# EAGLE design ArduinoLFO_Main (EAGLE 7.2.0)
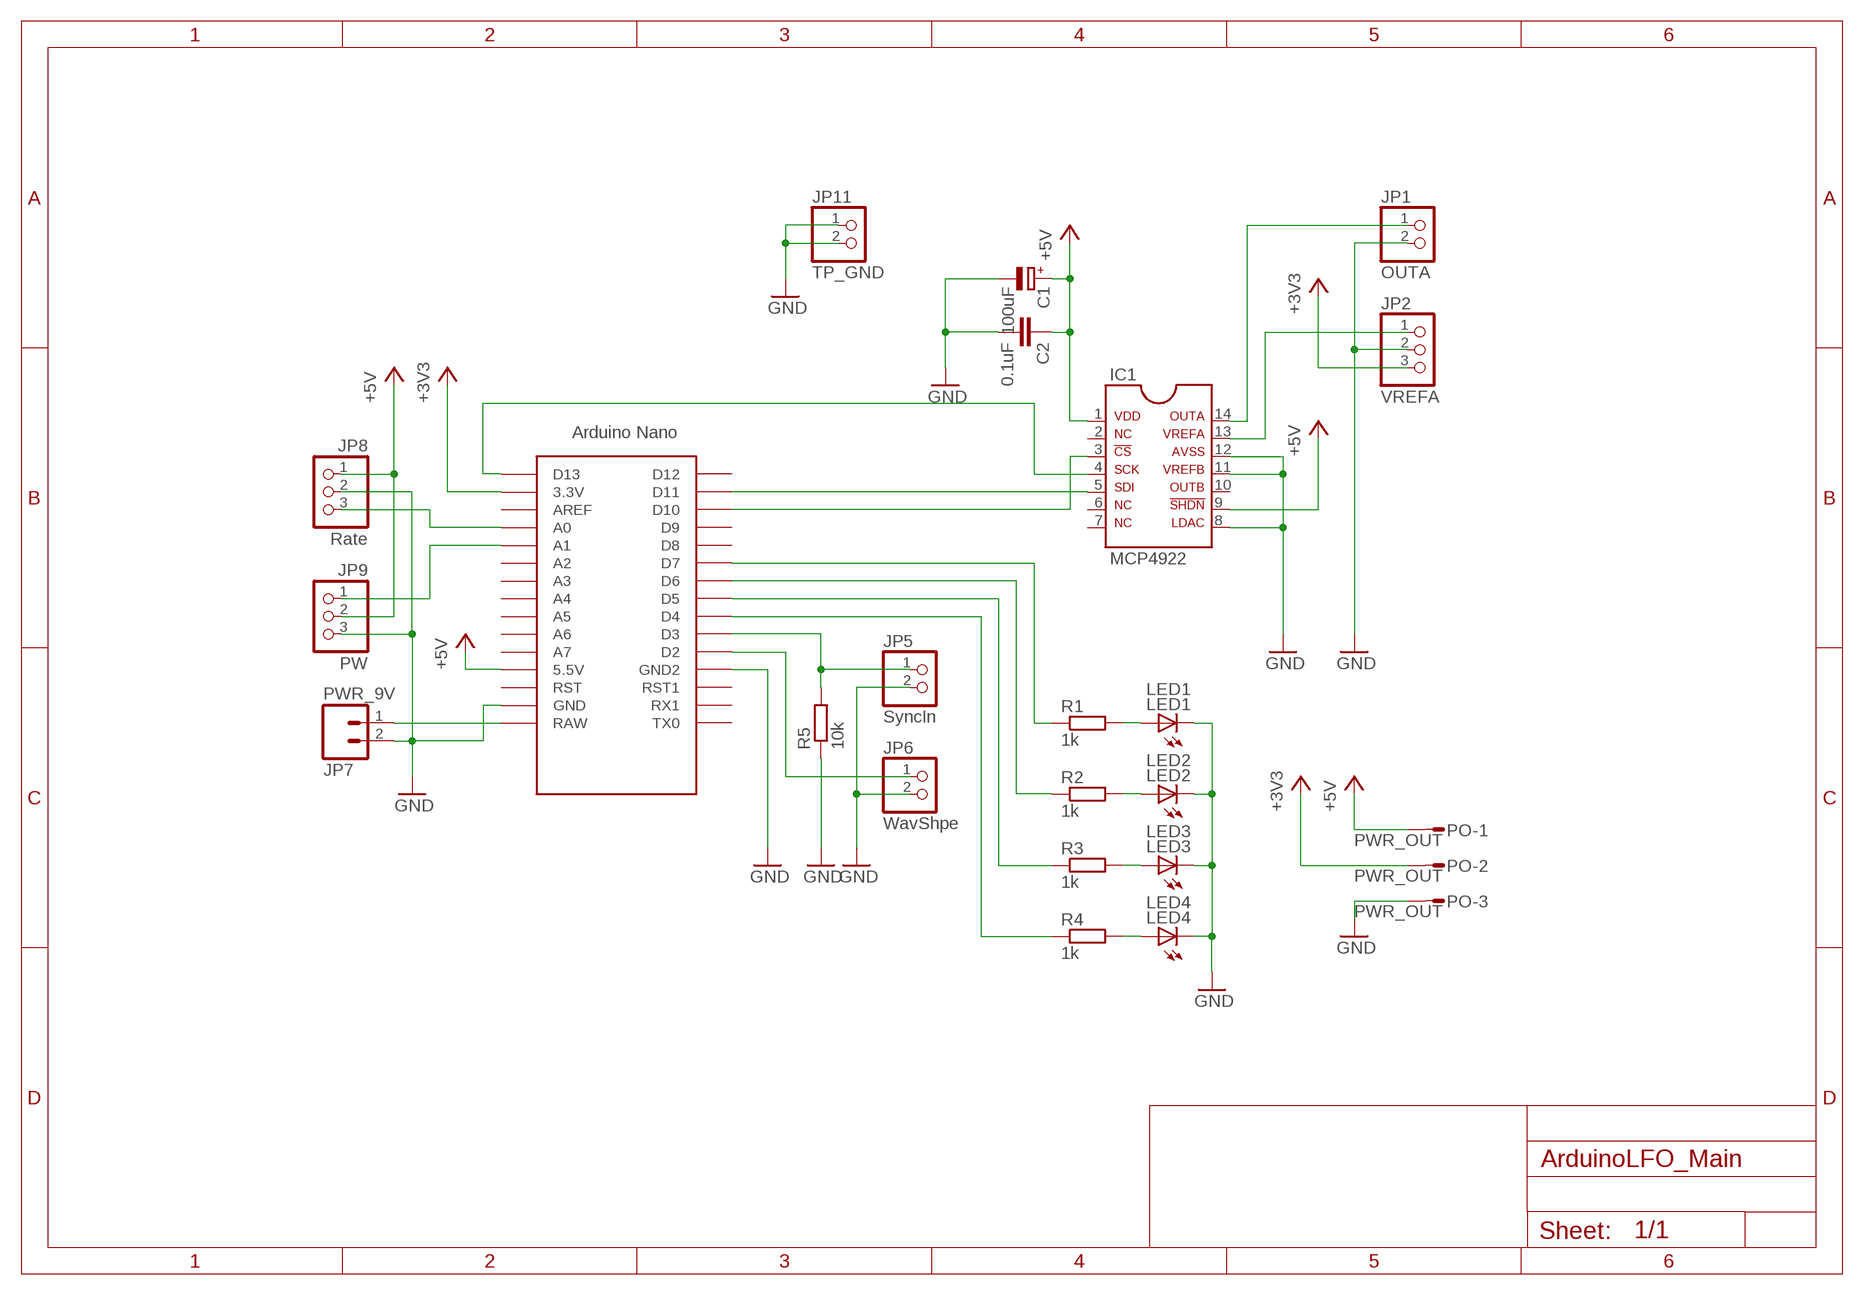
[diagram p0: schematic, sheet 1]

## Parts
C1  100uF  CPOL-EUE2.5-7  [E2,5-7]
C2  0.1uF  C-EU025-024X044  [C025-024X044]
IC1  MCP4922  [MCP4922]
JP1  OUTA  PINHD-1X2  [1X02]
JP2  VREFA  PINHD-1X3  [1X03]
JP5  SyncIn  PINHD-1X2  [1X02]
JP6  WavShpe  PINHD-1X2  [1X02]
JP7  PWR_9V  MA02  [02PA]
JP8  Rate  PINHD-1X3  [1X03]
JP9  PW  PINHD-1X3  [1X03]
JP11  TP_GND  PINHD-1X2  [1X02]
LED1  LED1  LED3MM  [LED3MM]
LED2  LED2  LED3MM  [LED3MM]
LED3  LED3  LED3MM  [LED3MM]
LED4  LED4  LED3MM  [LED3MM]
PO  PWR_OUT  MA03S  [03PA]
R1  1k  R-EU_0204/2V  [0204V]
R2  1k  R-EU_0204/2V  [0204V]
R3  1k  R-EU_0204/2V  [0204V]
R4  1k  R-EU_0204/2V  [0204V]
R5  10k  R-EU_0207/7  [0207/7]
U$1  NANO  [NANO]

## Nets
+3V3: JP2.3 PO.2 U$1.3.3V
+5V: C1.+ C2.1 IC1.1 IC1.9 JP8.1 JP9.2 PO.1 U$1.5V(5.5V)
GND: C1.- C2.2 IC1.8 IC1.11 IC1.12 JP1.2 JP2.2 JP5.2 JP6.2 JP7.2 JP8.2 JP9.3 JP11.1 JP11.2 LED1.K(C) LED2.K(C) LED3.K(C) LED4.K(C) PO.3 R5.1 U$1.GND U$1.GND1(GND2)
N$1: IC1.4 U$1.D13
N$2: IC1.5 U$1.D11
N$3: IC1.3 U$1.D10
N$4: JP8.3 U$1.A0
N$6: IC1.14 JP1.1
N$7: IC1.13 JP2.1
N$10: JP9.1 U$1.A1
N$11: JP7.1 U$1.RAW
N$15: LED1.A R1.2
N$16: LED2.A R2.2
N$17: LED3.A R3.2
N$18: LED4.A R4.2
N$19: R1.1 U$1.D7
N$20: R2.1 U$1.D6
N$21: R3.1 U$1.D5
N$22: R4.1 U$1.D4
N$23: JP5.1 R5.2 U$1.D3
N$24: JP6.1 U$1.D2
Unconnected: IC1.2 IC1.6 IC1.7 IC1.10 U$1.A2 U$1.A3 U$1.A4 U$1.A5 U$1.A6 U$1.A7 U$1.AREF U$1.D8 U$1.D9 U$1.D12 U$1.ICSP1 U$1.ICSP2 U$1.ICSP3 U$1.ICSP4 U$1.ICSP5 U$1.ICSP6 U$1.RST U$1.RST1 U$1.RX1 U$1.TX0

## Library data of the parts
C1 = rcl:CPOL-EU: POLARIZED CAPACITOR, European symbol
C2 = rcl:C-EU: CAPACITOR, European symbol
IC1 = mylib2:MCP4922
JP1 JP5 JP6 = my_pinhead:PINHD-1X2: PIN HEADER
JP2 = my_pinhead:PINHD-1X3: PIN HEADER
JP7 = con-amp-quick:MA02: AMP QUICK CONNECTOR; OC_FARNELL: unknown; OC_NEWARK: unknown
JP8 JP9 = pinhead:PINHD-1X3: PIN HEADER
JP11 = pinhead:PINHD-1X2: PIN HEADER
LED1-LED4 = led:LED: LED OSRAM: - CHIPLED LG R971, LG N971, LY N971, LG Q971, LY Q971, LO R971, LY R971 LH N974, LH R974 LS Q976, LO Q976, LY Q976 LO Q996 - Hyper CHIPLED LW Q18S LB Q993, LB Q99A, LB R99A - SideLED LS A670, LO A670, LY A670, LG A670, LP A670 LB A673, LV A673, LT A673, LW A673 LH A674 LY A675 LS A676, LA A676, LO A676, LY A676, LW A676 LS A679, LY A679, LG A679 - Hyper Micro SIDELED® LS Y876, LA Y876, LO Y876, LY Y876 LT Y87S - SmartLED LW L88C, LW L88S LB L89C, LB L89S, LG L890 LS L89K, LO L89K, LY L89K LS L896, LA L896, LO L896, LY L896 - TOPLED LS T670, LO T670, LY T670, LG T670, LP T670 LSG T670, LSP T670, LSY T670, LOP T670, LYG T670 LG T671, LOG T671, LSG T671 LB T673, LV T673, LT T673, LW T673 LH T674 LS T676, LA T676, LO T676, LY T676, LB T676, LH T676, LSB T676, LW T676 LB T67C, LV T67C, LT T67C, LS T67K, LO T67K, LY T67K, LW E67C LS E67B, LA E67B, LO E67B, LY E67B, LB E67C, LV E67C, LT E67C LW T67C LS T679, LY T679, LG T679 LS T770, LO T770, LY T770, LG T770, LP T770 LB T773, LV T773, LT T773, LW T773 LH T774 LS E675, LA E675, LY E675, LS T675 LS T776, LA T776, LO T776, LY T776, LB T776 LHGB T686 LT T68C, LB T68C - Hyper Mini TOPLED® LB M676 - Mini TOPLED Santana® LG M470 LS M47K, LO M47K, LY M47K Source: http://www.osram.convergy.de LUXEON: - LUMILED® LXK2-PW12-R00, LXK2-PW12-S00, LXK2-PW14-U00, LXK2-PW14-V00 LXK2-PM12-R00, LXK2-PM12-S00, LXK2-PM14-U00 LXK2-PE12-Q00, LXK2-PE12-R00, LXK2-PE12-S00, LXK2-PE14-T00, LXK2-PE14-U00 LXK2-PB12-K00, LXK2-PB12-L00, LXK2-PB12-M00, LXK2-PB14-N00, LXK2-PB14-P00, LXK2-PB14-Q00 LXK2-PR12-L00, LXK2-PR12-M00, LXK2-PR14-Q00, LXK2-PR14-R00 LXK2-PD12-Q00, LXK2-PD12-R00, LXK2-PD12-S00 LXK2-PH12-R00, LXK2-PH12-S00 LXK2-PL12-P00, LXK2-PL12-Q00, LXK2-PL12-R00 Source: www.luxeon.com KINGBRIGHT: KA-3528ASYC Source: www.kingbright.com
PO = con-amp-quick:MA03S: AMP QUICK CONNECTOR; OC_FARNELL: unknown; OC_NEWARK: unknown
R1-R5 = rcl:R-EU_: RESISTOR, European symbol
U$1 = Arduino-clone:NANO: Arduino Nano

## Board
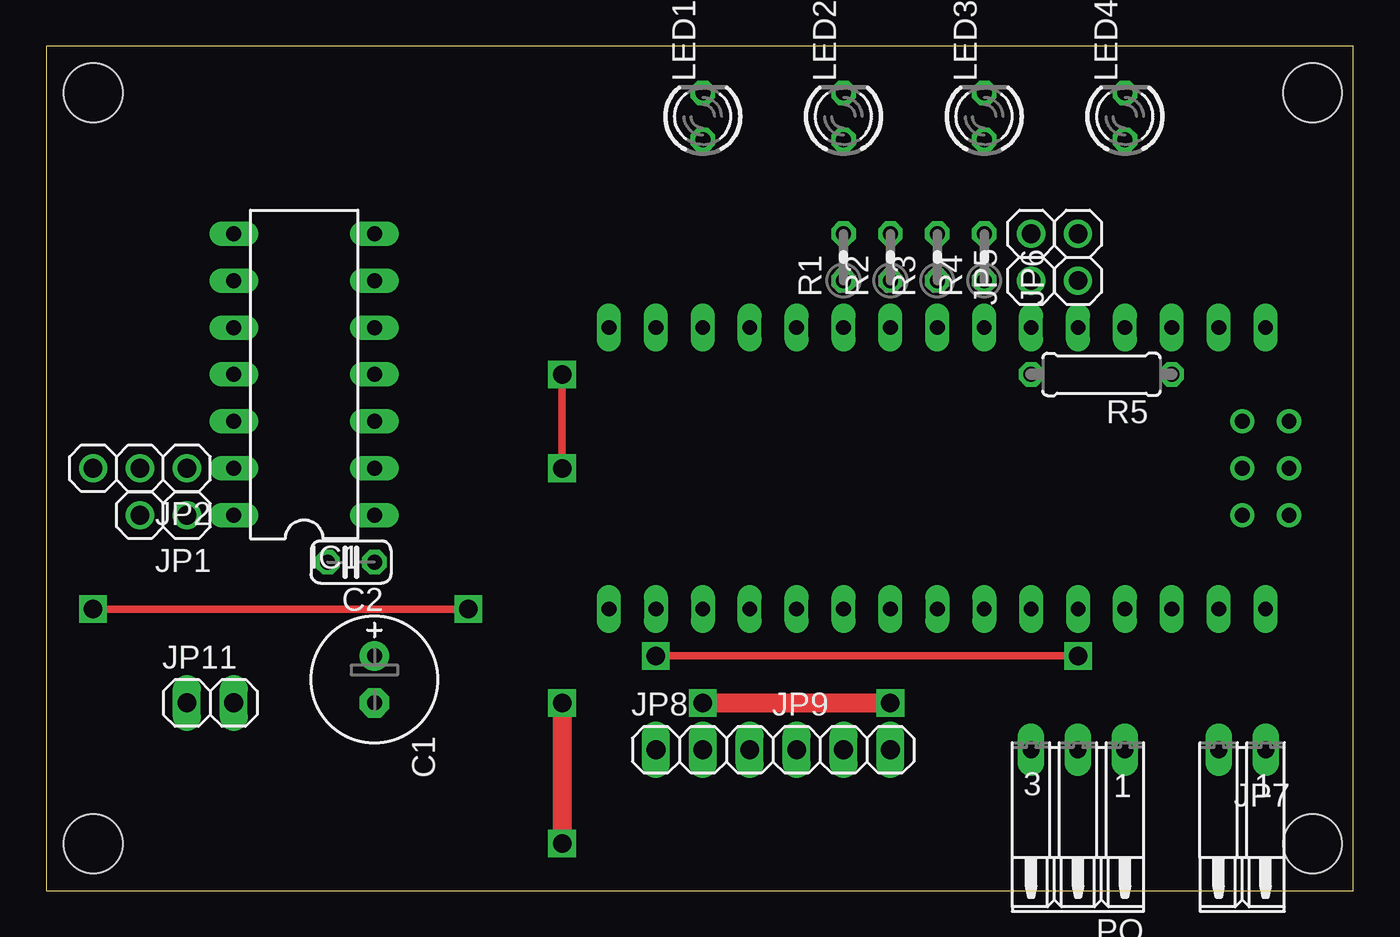
[diagram p1: board, top side]
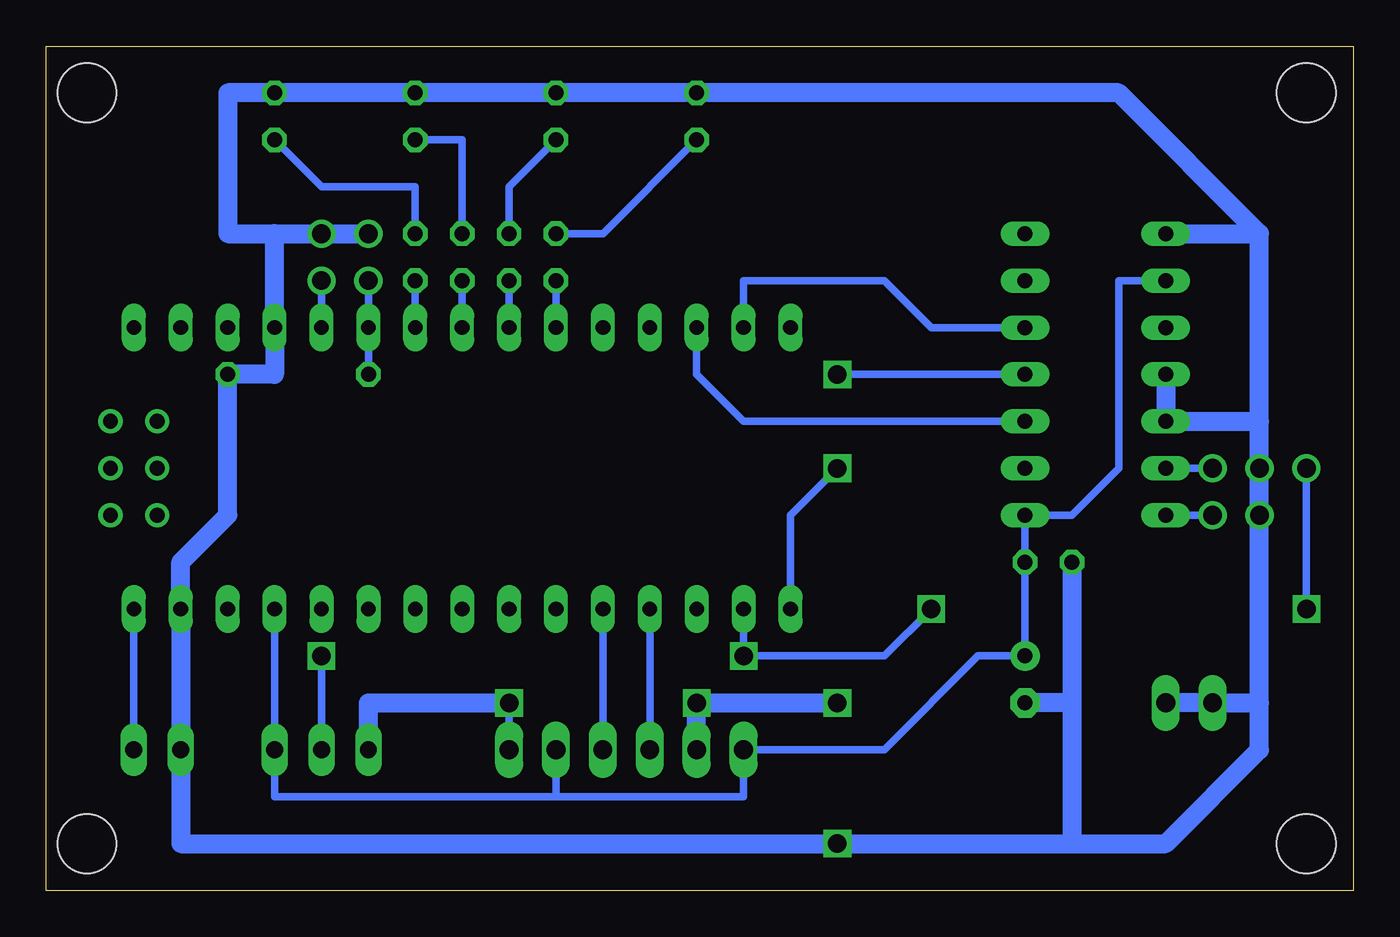
[diagram p2: board, bottom side, seen from below]

Size 70.79 x 45.71 mm. Coordinates in mm from the lower left corner, seen from the top.
Outline: 0,0 70.79,0 70.79,45.71 0,45.71 0,0
Copper layers (1*16): Top 0.035mm / dielectric 1.5mm / Bottom 0.035mm
Design rules "default": minimum track width 10mil, minimum drill 24mil, track to track 8mil, track to pad 8mil, pad to pad 8mil, via to via 8mil, smd to smd 8mil, copper to edge 40mil, drill to drill 8mil, minimum pad ring 10mil, minimum via ring 8mil, stop-mask expansion 4mil, vias tented up to drill 0mil, thermal gap 10mil
Holes 3.2 mm at 2.54,2.54 2.54,43.18 68.58,43.18 68.58,2.54

### Footprints (pad centres in the part's own frame; a part is rotated, then mirrored left to right if it is on the bottom)
E2,5-7 = drill 0.813 pad 1.6: + -1.27,0 | drill 0.813 pad 1.6 octagon: - 1.27,0
C025-024X044 = drill 0.813 octagon: 1 -1.27,0; 2 1.27,0
MCP4922 = drill 0.813 long: 1 -6.35,-3.81; 2 -3.81,-3.81; 3 -1.27,-3.81; 4 1.27,-3.81; 5 3.81,-3.81; 6 6.35,-3.81; 7 8.89,-3.81; 8 8.89,3.81; 9 6.35,3.81; 10 3.81,3.81; 11 1.27,3.81; 12 -1.27,3.81; 13 -3.81,3.81; 14 -6.35,3.81
1X02 = drill 1.016: 1 -1.27,0; 2 1.27,0
1X03 = drill 1.016: 1 -2.54,0; 2 0,0; 3 2.54,0
02PA = drill 0.914 long: 1 -1.27,0; 2 1.27,0
1X03' = drill 1.016 long: 1 -2.54,0; 2 0,0; 3 2.54,0
1X02' = drill 1.016 long: 1 -1.27,0; 2 1.27,0
LED3MM = drill 0.813 octagon: A -1.27,0; K 1.27,0
03PA = drill 0.914 long: 1 -2.54,0; 2 0,0; 3 2.54,0
0204V = drill 0.813 octagon: 1 -1.27,0; 2 1.27,0
0207/7 = drill 0.813 octagon: 1 -3.81,0; 2 3.81,0
NANO = drill 0.8 long: 3.3V -10.16,24.13; 5V -10.16,-1.27; A0 -10.16,19.05; A1 -10.16,16.51; A2 -10.16,13.97; A3 -10.16,11.43; A4 -10.16,8.89; A5 -10.16,6.35; A6 -10.16,3.81; A7 -10.16,1.27; AREF -10.16,21.59; D2 5.08,1.27; D3 5.08,3.81; D4 5.08,6.35; D5 5.08,8.89; D6 5.08,11.43; D7 5.08,13.97; D8 5.08,16.51; D9 5.08,19.05; D10 5.08,21.59; D11 5.08,24.13; D12 5.08,26.67; D13 -10.16,26.67; GND -10.16,-6.35; GND1 5.08,-1.27; RAW -10.16,-8.89; RST -10.16,-3.81; RST1 5.08,-3.81; RX1 5.08,-6.35; TX0 5.08,-8.89 | drill 0.8: ICSP1 -5.08,-10.16; ICSP2 -5.08,-7.62; ICSP3 -2.54,-10.16; ICSP4 -2.54,-7.62; ICSP5 0,-10.16; ICSP6 0,-7.62

### Placement (x,y rotation side)
C1  17.78,11.43 270 top
C2  16.51,17.78 180 top
IC1  13.97,26.67 90 top
JP1  6.35,20.32 180 top
JP2  5.08,22.86 180 top
JP5  53.34,34.29 90 top
JP6  55.88,34.29 90 top
JP7  64.77,7.62 180 top
JP8  Rate  [1X03']  35.56,7.62 0 top
JP9  PW  [1X03']  43.18,7.62 0 top
JP11  TP_GND  [1X02']  8.89,10.16 0 top
LED1  35.56,41.91 90 top
LED2  43.18,41.91 90 top
LED3  50.8,41.91 90 top
LED4  58.42,41.91 90 top
PO  55.88,7.62 180 top
R1  43.18,34.29 90 top
R2  45.72,34.29 90 top
R3  48.26,34.29 90 top
R4  50.8,34.29 90 top
R5  57.15,27.94 180 top
U$1  57.15,25.4 90 top

### Tracks (layer width: path | path; a pad name or v marks a point on that pad's centre or on a via)
+3V3  (via drill 1)
  Top 0.406: v33.02,12.7 v55.88,12.7 | v2.54,15.24 v22.86,15.24
  Bottom 0.406: U$1.3.3V v33.02,12.7 25.4,12.7 v22.86,15.24 | v55.88,12.7 PO.2 | JP2.3 v2.54,15.24
+5V
  Bottom 0.406: 43.18,5.08 58.42,5.08 PO.1 U$1.5V | 43.18,5.08 33.02,5.08 JP8.1 25.4,7.62 20.32,12.7 C1.+ C2.1 IC1.1 15.24,20.32 12.7,22.86 12.7,33.02 IC1.9 | JP9.2 43.18,5.08
GND  (via drill 1)
  Top 1.016: v35.56,10.16 v45.72,10.16 | v27.94,10.16 v27.94,2.54
  Bottom 0.406: v45.72,10.16 JP9.3
  Bottom 1.016: 5.08,25.4 JP2.2 JP1.2 5.08,10.16 | 5.08,25.4 5.08,35.56 | 5.08,35.56 12.7,43.18 LED1.K LED2.K LED3.K LED4.K 60.96,43.18 60.96,35.56 58.42,35.56 | 58.42,35.56 JP6.2 JP5.2 | 58.42,35.56 U$1.GND1 58.42,27.94 R5.1 60.96,20.32 63.5,17.78 U$1.GND JP7.2 63.5,2.54 v27.94,2.54 15.24,2.54 | 15.24,2.54 10.16,2.54 5.08,7.62 5.08,10.16 | 5.08,25.4 IC1.12 IC1.11 | PO.3 53.34,10.16 v45.72,10.16 | JP11.2 JP11.1 5.08,10.16 | 15.24,10.16 C1.- | v27.94,10.16 v35.56,10.16 JP8.2 | C2.2 15.24,10.16 | 15.24,10.16 15.24,2.54 | IC1.8 5.08,35.56
N$1  (via drill 1)
  Top 0.406: v27.94,27.94 v27.94,22.86
  Bottom 0.406: IC1.4 v27.94,27.94 | v27.94,22.86 30.48,20.32 U$1.D13
N$2
  Bottom 0.406: IC1.5 22.86,30.48 25.4,33.02 33.02,33.02 U$1.D11
N$3
  Bottom 0.406: IC1.3 33.02,25.4 35.56,27.94 U$1.D10
N$4
  Bottom 0.406: U$1.A0 JP8.3
N$6
  Bottom 0.406: JP1.1 IC1.14
N$7
  Bottom 0.406: IC1.13 JP2.1
N$10
  Bottom 0.406: U$1.A1 JP9.1
N$11
  Bottom 0.406: U$1.RAW JP7.1
N$15
  Bottom 0.406: R1.2 40.64,35.56 LED1.A
N$16
  Bottom 0.406: R2.2 45.72,38.1 LED2.A
N$17
  Bottom 0.406: R3.2 48.26,40.64 LED3.A
N$18
  Bottom 0.406: R4.2 50.8,38.1 55.88,38.1 LED4.A
N$19
  Bottom 0.406: U$1.D7 R1.1
N$20
  Bottom 0.406: U$1.D6 R2.1
N$21
  Bottom 0.406: U$1.D5 R3.1
N$22
  Bottom 0.406: U$1.D4 R4.1
N$23
  Bottom 0.406: R5.2 U$1.D3 JP5.1
N$24
  Bottom 0.406: JP6.1 U$1.D2